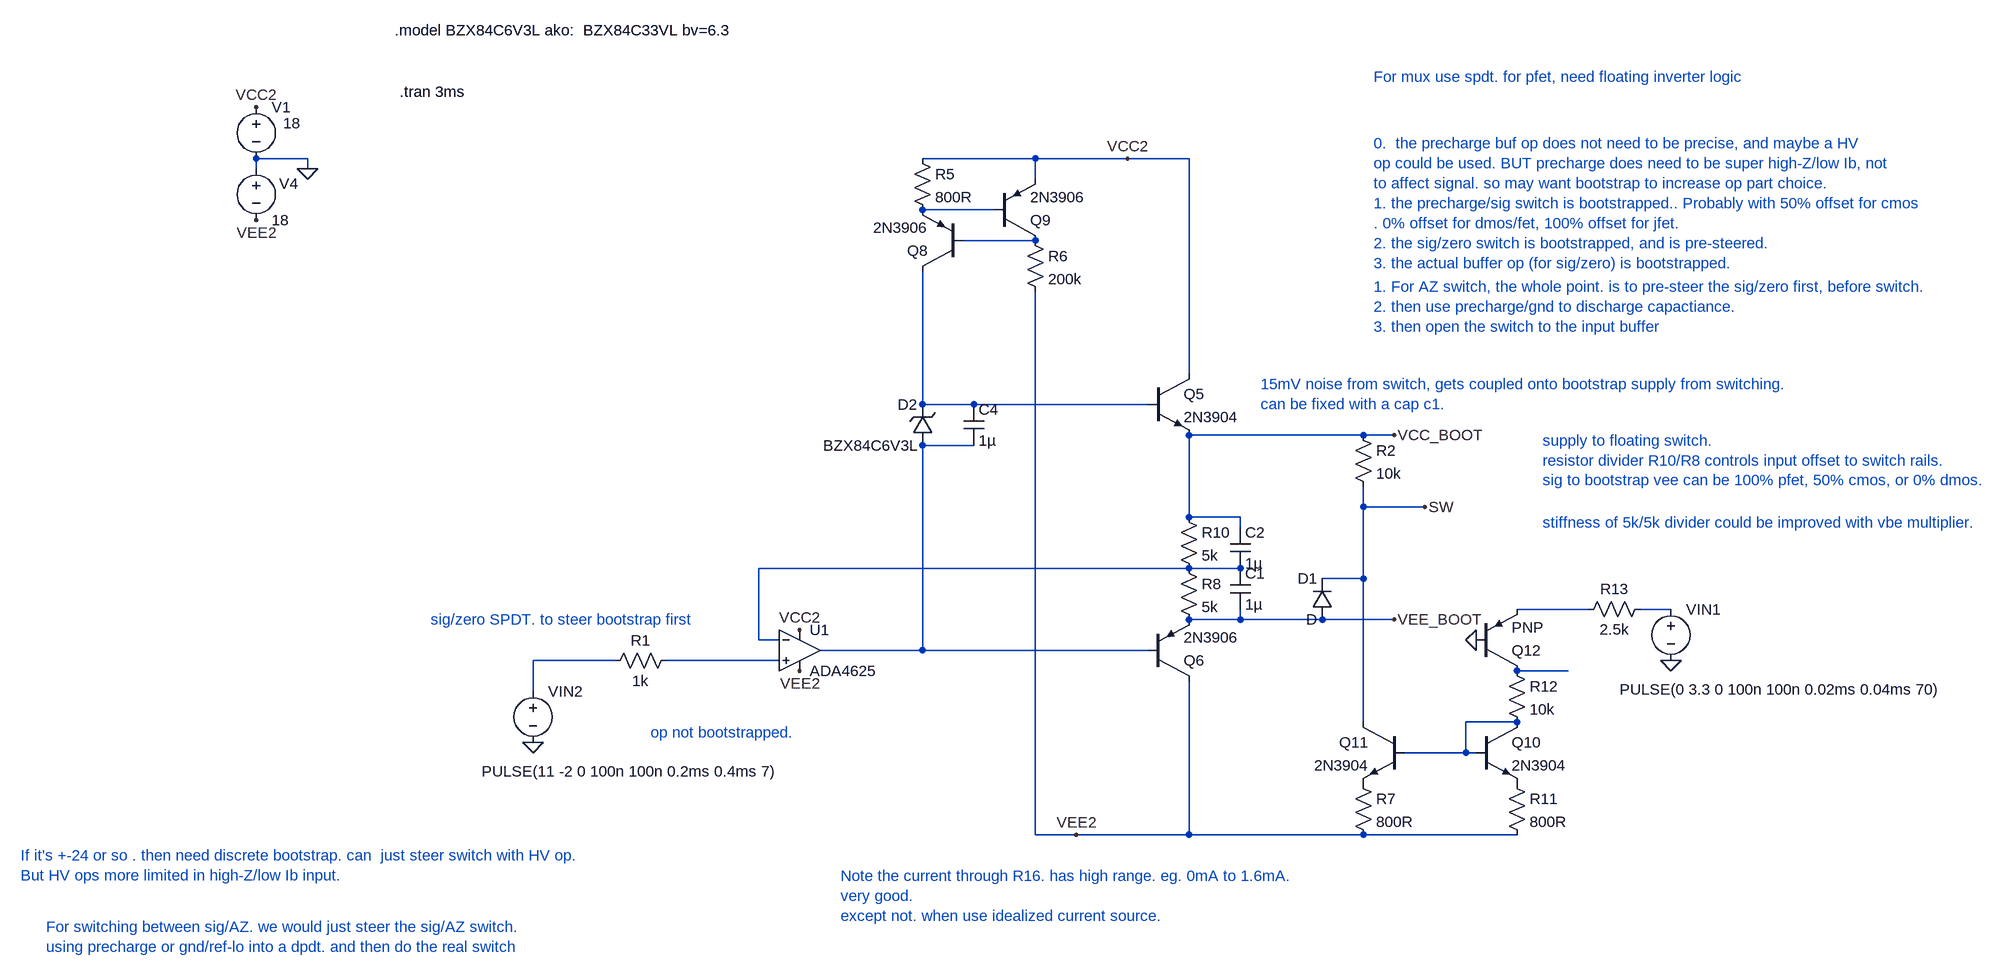
[diagram p0: schematic Draft55.asc]
Draft55.asc, the LTspice schematic file:
Version 4
SHEET 1 2756 1020
WIRE -256 -288 -336 -288
WIRE 880 -288 704 -288
WIRE 1024 -288 880 -288
WIRE 1120 -288 1024 -288
WIRE -336 -272 -336 -288
WIRE -256 -272 -256 -288
WIRE 880 -256 880 -288
WIRE 816 -208 704 -208
WIRE 880 -160 768 -160
WIRE 1120 48 1120 -288
WIRE 704 96 704 -112
WIRE 784 96 704 96
WIRE 1056 96 784 96
WIRE 1392 144 1120 144
WIRE 1440 144 1392 144
WIRE 784 160 704 160
WIRE 1392 256 1392 224
WIRE 1488 256 1392 256
WIRE 1120 272 1120 144
WIRE 1200 272 1120 272
WIRE 1200 288 1200 272
WIRE 1120 352 448 352
WIRE 1200 352 1120 352
WIRE 1392 368 1392 256
WIRE 1392 368 1328 368
WIRE 1744 416 1632 416
WIRE 1872 416 1824 416
WIRE 1200 432 1200 416
WIRE 1200 432 1120 432
WIRE 1328 432 1200 432
WIRE 1440 432 1328 432
WIRE 448 464 448 352
WIRE 480 464 448 464
WIRE 704 480 704 160
WIRE 704 480 544 480
WIRE 1056 480 704 480
WIRE 224 496 96 496
WIRE 480 496 304 496
WIRE 1712 512 1632 512
WIRE 96 544 96 496
WIRE 1392 592 1392 368
WIRE 1632 592 1552 592
WIRE 1552 640 1552 592
WIRE 1552 640 1456 640
WIRE 1568 640 1552 640
WIRE 880 768 880 -80
WIRE 944 768 880 768
WIRE 1120 768 1120 528
WIRE 1120 768 944 768
WIRE 1392 768 1120 768
WIRE 1632 768 1392 768
FLAG -256 -272 0
FLAG -336 -368 VCC2
FLAG -336 -192 VEE2
FLAG 944 768 VEE2
FLAG 96 624 0
FLAG 1440 144 VCC_BOOT
FLAG 1440 432 VEE_BOOT
FLAG 1024 -288 VCC2
FLAG 1488 256 SW
FLAG 1872 496 0
FLAG 1568 464 0
FLAG 512 448 VCC2
FLAG 512 512 VEE2
SYMBOL voltage -336 -384 R0
WINDOW 123 0 0 Left 0
WINDOW 39 0 0 Left 0
WINDOW 3 42 41 Left 2
SYMATTR Value 18
SYMATTR InstName V1
SYMBOL voltage -336 -288 R0
WINDOW 123 0 0 Left 0
WINDOW 39 0 0 Left 0
WINDOW 0 36 39 Left 2
SYMATTR InstName V4
SYMATTR Value 18
SYMBOL npn 1056 48 R0
SYMATTR InstName Q5
SYMATTR Value 2N3904
SYMBOL pnp 1056 528 M180
SYMATTR InstName Q6
SYMATTR Value 2N3906
SYMBOL voltage 96 528 R0
WINDOW 123 0 0 Left 0
WINDOW 39 0 0 Left 0
WINDOW 3 -80 141 Left 2
SYMATTR Value PULSE(11 -2 0 100n 100n 0.2ms 0.4ms 7)
SYMATTR InstName VIN2
SYMBOL res 320 480 R90
WINDOW 0 0 56 VBottom 2
WINDOW 3 32 56 VTop 2
SYMATTR InstName R1
SYMATTR Value 1k
SYMBOL cap 768 96 R0
SYMATTR InstName C4
SYMATTR Value 1µ
SYMBOL zener 720 160 R180
WINDOW 0 24 64 Left 2
WINDOW 3 24 0 Left 2
SYMATTR InstName D2
SYMATTR Value BZX84C6V3L
SYMBOL pnp 768 -112 R180
SYMATTR InstName Q8
SYMATTR Value 2N3906
SYMBOL pnp 816 -160 M180
SYMATTR InstName Q9
SYMATTR Value 2N3906
SYMBOL res 688 -304 R0
SYMATTR InstName R5
SYMATTR Value 800R
SYMBOL res 864 -176 R0
SYMATTR InstName R6
SYMATTR Value 200k
SYMBOL res 1104 336 R0
SYMATTR InstName R8
SYMATTR Value 5k
SYMBOL res 1104 256 R0
SYMATTR InstName R10
SYMATTR Value 5k
SYMBOL res 1376 128 R0
SYMATTR InstName R2
SYMATTR Value 10k
SYMBOL diode 1344 432 R180
WINDOW 0 24 64 Left 2
WINDOW 3 24 0 Left 2
SYMATTR InstName D1
SYMBOL npn 1568 592 R0
SYMATTR InstName Q10
SYMATTR Value 2N3904
SYMBOL npn 1456 592 M0
SYMATTR InstName Q11
SYMATTR Value 2N3904
SYMBOL res 1376 672 R0
SYMATTR InstName R7
SYMATTR Value 800R
SYMBOL res 1616 672 R0
SYMATTR InstName R11
SYMATTR Value 800R
SYMBOL voltage 1872 400 R0
WINDOW 123 0 0 Left 0
WINDOW 39 0 0 Left 0
WINDOW 3 -80 141 Left 2
SYMATTR Value PULSE(0 3.3 0 100n 100n 0.02ms 0.04ms 70)
SYMATTR InstName VIN1
SYMBOL res 1616 496 R0
SYMATTR InstName R12
SYMATTR Value 10k
SYMBOL pnp 1568 512 M180
SYMATTR InstName Q12
SYMBOL res 1840 400 R90
WINDOW 0 0 56 VBottom 2
WINDOW 3 32 56 VTop 2
SYMATTR InstName R13
SYMATTR Value 2.5k
SYMBOL OpAmps\\ADA4625 512 416 R0
SYMATTR InstName U1
SYMBOL cap 1184 352 R0
SYMATTR InstName C1
SYMATTR Value 1µ
SYMBOL cap 1184 288 R0
SYMATTR InstName C2
SYMATTR Value 1µ
TEXT -112 -392 Left 2 !.tran 3ms
TEXT 576 832 Left 2 ;Note the current through R16. has high range. eg. 0mA to 1.6mA.\nvery good.\nexcept not. when use idealized current source.
TEXT -664 912 Left 2 ;For switching between sig/AZ. we would just steer the sig/AZ switch.\nusing precharge or gnd/ref-lo into a dpdt. and then do the real switch
TEXT -64 432 Left 2 ;sig/zero SPDT. to steer bootstrap first
TEXT 1672 152 Left 2 ;supply to floating switch. \nresistor divider R10/R8 controls input offset to switch rails.\nsig to bootstrap vee can be 100% pfet, 50% cmos, or 0% dmos.
TEXT 1408 -88 Left 2 ;1. For AZ switch, the whole point. is to pre-steer the sig/zero first, before switch. \n2. then use precharge/gnd to discharge capactiance.\n3. then open the switch to the input buffer
TEXT -704 800 Left 2 ;If it's +-24 or so . then need discrete bootstrap. can  just steer switch with HV op.\nBut HV ops more limited in high-Z/low Ib input.
TEXT 1408 -312 Left 2 ;0.  the precharge buf op does not need to be precise, and maybe a HV \nop could be used. BUT precharge does need to be super high-Z/low Ib, not\nto affect signal. so may want bootstrap to increase op part choice.\n1. the precharge/sig switch is bootstrapped.. Probably with 50% offset for cmos\n. 0% offset for dmos/fet, 100% offset for jfet.\n2. the sig/zero switch is bootstrapped, and is pre-steered.\n3. the actual buffer op (for sig/zero) is bootstrapped.
TEXT -120 -488 Left 2 !.model BZX84C6V3L ako:  BZX84C33VL bv=6.3
TEXT 1408 -416 Left 2 ;For mux use spdt. for pfet, need floating inverter logic
TEXT 1672 280 Left 2 ;stiffness of 5k/5k divider could be improved with vbe multiplier.
TEXT 280 608 Left 2 ;op not bootstrapped.
TEXT 1232 64 Left 2 ;15mV noise from switch, gets coupled onto bootstrap supply from switching.\ncan be fixed with a cap c1.

The netlist it stands for:
* Draft55.asc
V1 VCC2 0 18
V4 0 VEE2 18
Q5 VCC2 N003 VCC_BOOT 0 2N3904
Q6 VEE2 N004 VEE_BOOT 0 2N3906
VIN2 N008 0 PULSE(11 -2 0 100n 100n 0.2ms 0.4ms 7)
R1 N009 N008 1k
C4 N003 N004 1µ
D2 N004 N003 BZX84C6V3L
Q8 N003 N002 N001 0 2N3906
Q9 N002 N001 VCC2 0 2N3906
R5 VCC2 N001 800R
R6 N002 VEE2 200k
R8 N005 VEE_BOOT 5k
R10 VCC_BOOT N005 5k
R2 VCC_BOOT SW 10k
D1 VEE_BOOT SW D
Q10 N011 N011 P001 0 2N3904
Q11 SW N011 P002 0 2N3904
R7 P002 VEE2 800R
R11 P001 VEE2 800R
VIN1 N007 0 PULSE(0 3.3 0 100n 100n 0.02ms 0.04ms 70)
R12 N010 N011 10k
Q12 N010 0 N006 0 PNP
R13 N007 N006 2.5k
XU1 N009 N005 VCC2 VEE2 N004 ADA4625  ; pins In+ In- V+ V- OUT
C1 N005 VEE_BOOT 1µ
C2 VCC_BOOT N005 1µ
.model D D
.lib standard.dio
.model NPN NPN
.model PNP PNP
.lib standard.bjt
.tran 3ms
* Note the current through R16. has high range. eg. 0mA to 1.6mA.
* very good.
* except not. when use idealized current source.
* For switching between sig/AZ. we would just steer the sig/AZ switch.
* using precharge or gnd/ref-lo into a dpdt. and then do the real switch
* sig/zero SPDT. to steer bootstrap first
* supply to floating switch.
* resistor divider R10/R8 controls input offset to switch rails.
* sig to bootstrap vee can be 100% pfet, 50% cmos, or 0% dmos.
* 1. For AZ switch, the whole point. is to pre-steer the sig/zero first, before switch.
* 2. then use precharge/gnd to discharge capactiance.
* 3. then open the switch to the input buffer
* If it's +-24 or so . then need discrete bootstrap. can  just steer switch with HV op.
* But HV ops more limited in high-Z/low Ib input.
* 0.  the precharge buf op does not need to be precise, and maybe a HV
* op could be used. BUT precharge does need to be super high-Z/low Ib, not
* to affect signal. so may want bootstrap to increase op part choice.
* 1. the precharge/sig switch is bootstrapped.. Probably with 50% offset for cmos
* . 0% offset for dmos/fet, 100% offset for jfet.
* 2. the sig/zero switch is bootstrapped, and is pre-steered.
* 3. the actual buffer op (for sig/zero) is bootstrapped.
.model BZX84C6V3L ako:  BZX84C33VL bv=6.3
* For mux use spdt. for pfet, need floating inverter logic
* stiffness of 5k/5k divider could be improved with vbe multiplier.
* op not bootstrapped.
* 15mV noise from switch, gets coupled onto bootstrap supply from switching.
* can be fixed with a cap c1.
.backanno
.end